# EAGLE schematic radio (EAGLE 7.7.0)
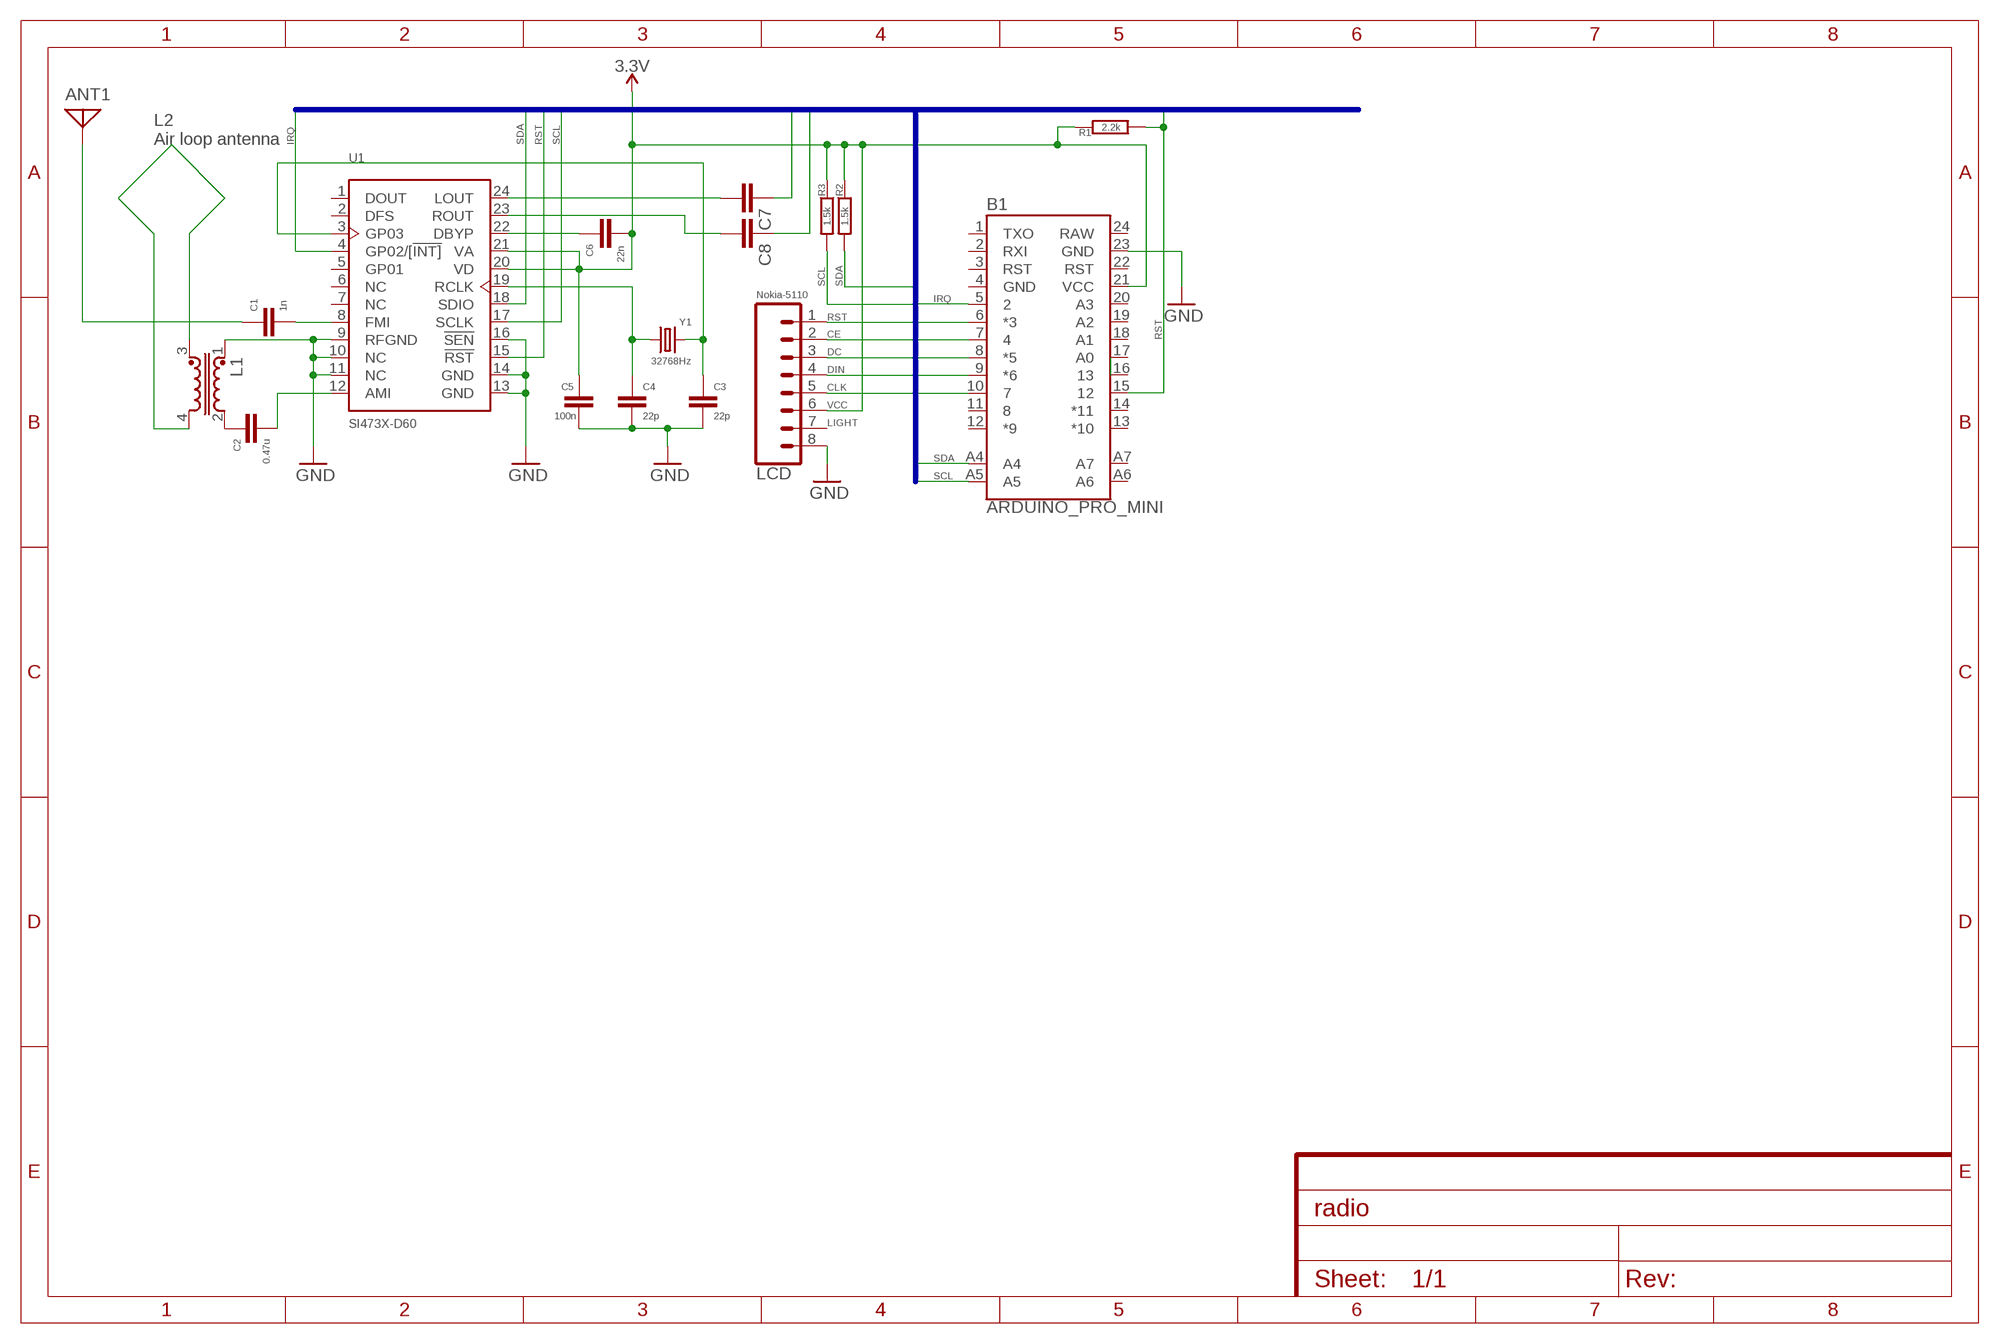
[diagram p0: schematic, sheet 1]

## Parts
ANT1  ANTENNA  [PAD-01]
B1  ARDUINO_PRO_MINI  [ARDUINO_PRO_MINI]
C1  1n  C-EU025-025X050  [C025-025X050]
C2  0.47u  C-EU025-025X050  [C025-025X050]
C3  22p  C-EU025-025X050  [C025-025X050]
C4  22p  C-EU025-025X050  [C025-025X050]
C5  100n  C-EU025-025X050  [C025-025X050]
C6  22n  C-EU025-025X050  [C025-025X050]
C7  C-EU025-025X050  [C025-025X050]
C8  C-EU025-025X050  [C025-025X050]
L1  U15-TRANSFORMER  [U15]
LCD  Nokia-5110  CONN_08"  [1X08]
R1  2.2k  R-EU_0204/7  [0204/7]
R2  1.5k  R-EU_0204/7  [0204/7]
R3  1.5k  R-EU_0204/7  [0204/7]
U1  SI473X-D60  [SSOP24]
Y1  32768Hz  CRYSTALPTH-3X8  [CRYSTAL-PTH-3X8-CYL]

## Nets
3.3V: B1.21(VCC) C5.1 C6.1 LCD.6 R1.1 R2.1 R3.1 U1.20(VD) U1.21(VA)
GND: B1.23(GND) C3.2 C4.2 C5.2 L1.1 LCD.8 U1.9(RFGND) U1.10(NC) U1.11(NC) U1.13(GND) U1.14(GND) U1.16(!SEN)
IRQ: B1.5 U1.4(GP02/[!INT])
LOUT: C7.1
N$1: C1.2 U1.8(FMI)
N$3: ANT1.1 C1.1
N$4: C2.2 L1.2
N$5: C2.1 U1.12(AMI)
N$6: L1.3 L1.4
N$7: C4.1 U1.19(RCLK) Y1.1
N$8: C3.1 U1.3(GP03) Y1.2
N$9: C6.2 U1.22(DBYP)
N$10: C7.2 U1.24(LOUT)
N$11: C8.2 U1.23(ROUT)
N$12: B1.6(*3) LCD.1
N$13: B1.7 LCD.2
N$14: B1.8(*5) LCD.3
N$15: B1.9(*6) LCD.4
N$16: B1.10 LCD.5
ROUT: C8.1
RST: B1.15 R1.2 U1.15(!RST)
SCL: B1.A5 R3.2 U1.17(SCLK)
SDA: B1.A4 R2.2 U1.18(SDIO)
Unconnected: B1.1(TXO) B1.2(RXI) B1.3(RST) B1.11 B1.12(*9) B1.13(*10) B1.14(*11) B1.16 B1.17(A0) B1.18(A1) B1.19(A2) B1.20(A3) B1.22(RST) B1.A6 B1.A7 LCD.7 U1.1(DOUT) U1.2(DFS) U1.5(GP01) U1.6(NC) U1.7(NC)

## Buses
IRQ,SDA,RST,SCL,LOUT,ROUT

## Notes on the sheet
- L2
  Air loop antenna
- RST
- CE
- DC
- DIN
- CLK
- VCC
- LIGHT

## Power pins joined to a net without a drawn wire
GND: B1.4(GND)
RAW: B1.24(RAW)

## Library data of the parts
ANT1 = discrete:ANTENNA: Antenna
B1 = SparkFun-Boards:ARDUINO_PRO_MINI: SparkFun Pro Mini Pro Mini compatible footprint. Dimensions: 0.7 x 1.3" PCB Thickness: 0.8mm SparkFun Products: 3.3V/8MHz <https://www.sparkfun.com/products/11114> 5V/16MHz <https://www.sparkfun.com/products/11113>
C1-C8 = rcl:C-EU: CAPACITOR, European symbol
L1 = inductor-neosid:U15: TRANSFORMER U15; OC_FARNELL: unknown; OC_NEWARK: unknown
LCD = SparkFun-Connectors:CONN_08: Multi connection point. Often used as Generic Header-pin footprint for 0.1 inch spaced/style header connections On any of the 0.1 inch spaced packages, you can populate with these: Break Away Headers - Straight <https://www.sparkfun.com/products/116> (PRT-00116) Break Away Male Headers - Right Angle <https://www.sparkfun.com/products/553> (PRT-00553) Female Headers <https://www.sparkfun.com/products/115> (PRT-00115) Break Away Headers - Machine Pin <https://www.sparkfun.com/products/117> (PRT-00117) Break Away Female Headers - Swiss Machine Pin <https://www.sparkfun.com/products/743> (PRT-00743) Arduino Stackable Header - 8 Pin <https://www.sparkfun.com/products/9279> (PRT-09279) For SCREWTERMINALS and SPRING TERMINALS visit here: Screw Terimnals on SparkFun.com <https://www.sparkfun.com/search/results?term=Screw+Terminals> (5mm/3.5mm/2.54mm spacing) This device is also useful as a general connection point to wire up your design to another part of your project. Our various solder wires solder well into these plated through hole pads. Hook-Up Wire - Assortment (Stranded, 22 AWG) <https://www.sparkfun.com/products/11375> (PRT-11375) Hook-Up Wire - Assortment (Solid Core, 22 AWG) <https://www.sparkfun.com/products/11367> (PRT-11367) View the entire wire category on our website here <https://www.sparkfun.com/categories/141> Special notes: Molex polarized connector foot print use with SKU : PRT-08231 with associated crimp pins and housings. 1MM SMD Version SKU: PRT-10208 NOTES ON THE VARIANTS LOCK and LOCK_LONGPADS... This footprint was designed to help hold the alignment of a through-hole component (i.e. 6-pin header) while soldering it into place. You may notice that each hole has been shifted either up or down by 0.005 of an inch from it's more standard position (which is a perfectly straight line). This slight alteration caused the pins (the squares in the middle) to touch the edges of the holes. Because they are alternating, it causes a "brace" to hold the component in place. 0.005 has proven to be the perfect amount of "off-center" position when using our standard breakaway headers. Although looks a little odd when you look at the bare footprint, once you have a header in there, the alteration is very hard to notice. Also,if you push a header all the way into place, it is covered up entirely on the bottom side.; PROD_ID: CONN-08438
R1-R3 = resistor:R-EU_: RESISTOR, European symbol
U1 = SparkFun-RF:SI473X-D60: The Si473x-D60 digital CMOS AM/FM radio receiver IC integrates the complete broadcast tuner and receiver function from antenna input to digital audio output. The device leverages the Silicon Labs broadcast proven digital low-IF architecture, enabling a cost-effective, digital audio platform for consumer electronic applications with high TDMA noise immunity, superior radio performance, and high fidelity audio power amplification.
Y1 = SparkFun-Clocks:CRYSTAL: Crystals (Generic) These are passive quartz crystals, which can be used as a clock source for a microcontroller. Crystal's are two-terminal devices. They require external "load" capacitors to generate an oscillating signal.